# Altium schematic sheet 18.SchDoc
size 420 x 297 mm
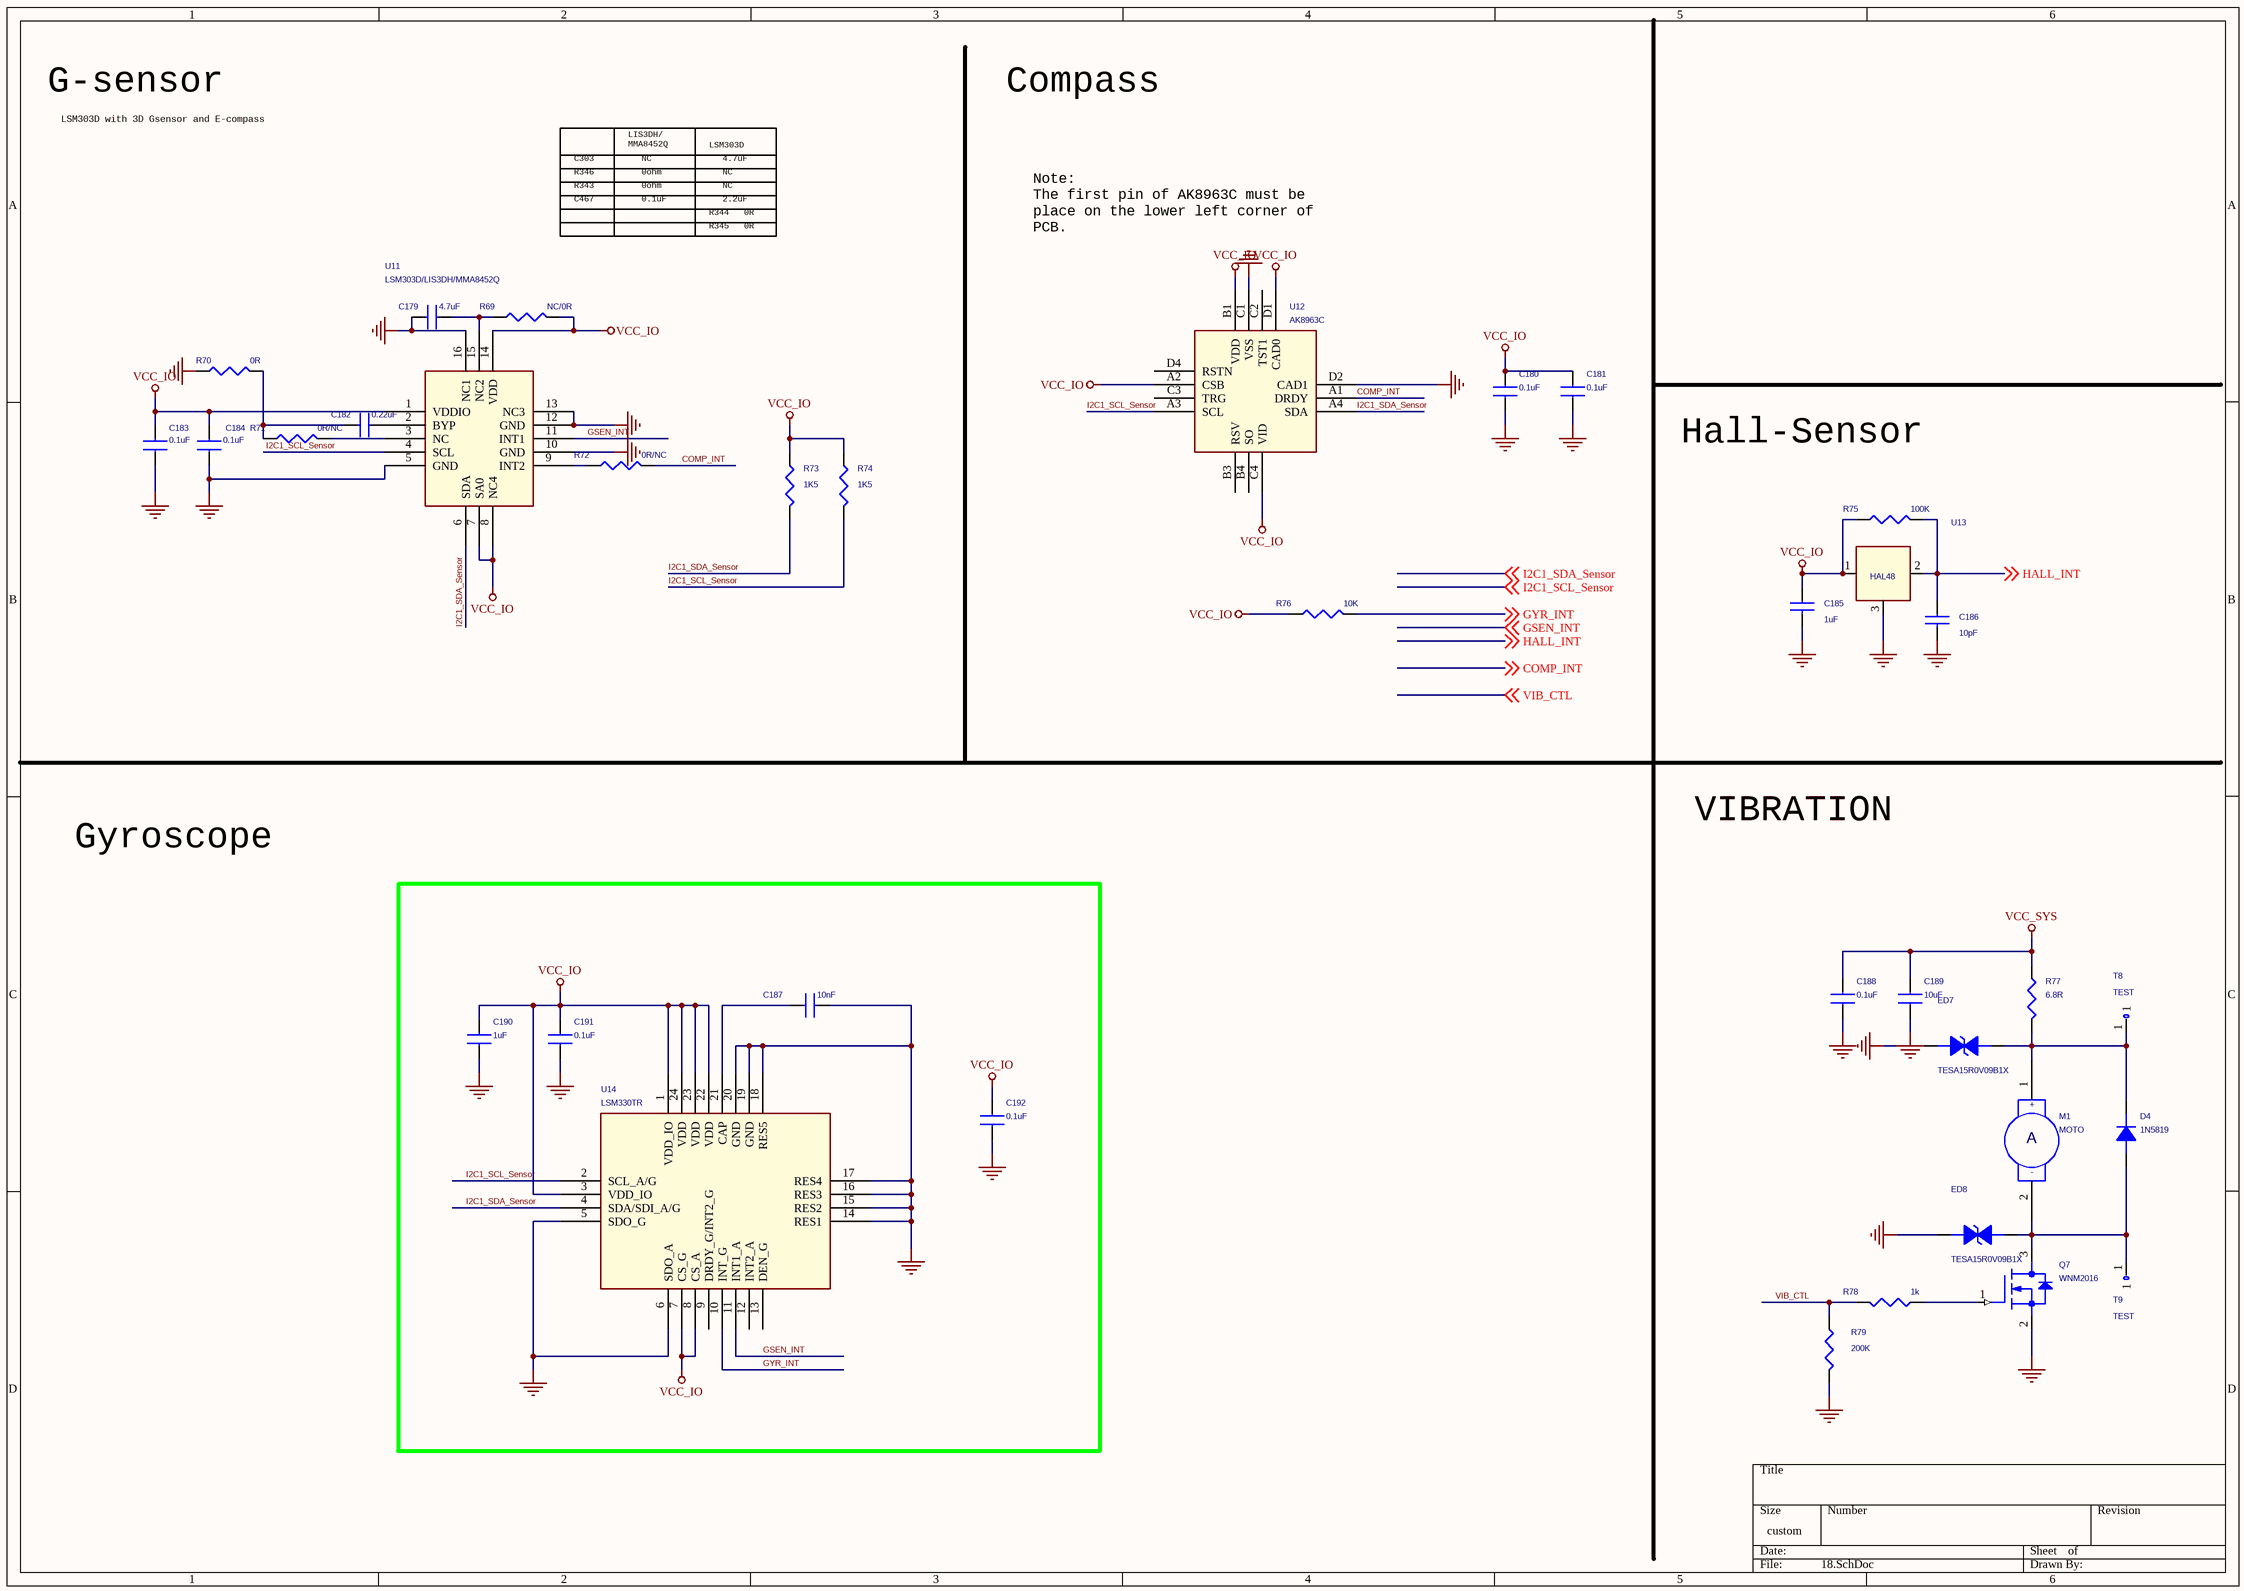
[diagram p0: 18.SchDoc]

## Parts
C179  4.7uF  [C0603]
C180  0.1uF  [C0603]
C181  0.1uF  [C0603]
C182  0.22uF  [C0603]
C183  0.1uF  [C0603]
C184  0.1uF  [C0603]
C185  1uF  [C0402]
C186  10pF  [C0402]
C187  10nF  [C0603]
C188  0.1uF  [C0603]
C189  10uF  [C0603]
C190  1uF  [C0603]
C191  0.1uF  [C0603]
C192  0.1uF  [C0603]
D4  1N5819  [SOD323]
ED7  TESA15R0V09B1X  [E0402N]
ED8  TESA15R0V09B1X  [E0402N]
M1  MOTO  [R1206]
Q7  WNM2016  [SOT23]
R69  NC/0R  [R0402]
R70  0R  [R0402]
R71  0R/NC  [R0402]
R72  0R/NC  [R0402]
R73  1K5  [r0402]
R74  1K5  [r0402]
R75  100K  [R0402]
R76  10K  [r0402]
R77  6.8R  [R0603]
R78  1k  [r0402]
R79  200K  [r0402]
T8  TEST  [TEST]
T9  TEST  [TEST]
U11  LSM303D/LIS3DH/MMA8452Q  [QFN16_COL]
U12  AK8963C  [AK8975B]
U13  HAL48  [SOT23]
U14  LSM330TR  [L3G4200D]

## Nets
GND: C179.2 C180.1 C181.1 C183.1 C184.1 C185.2 C186.2 C187.1 C188.1 C189.1 C190.1 C191.1 C192.1 ED7.1 ED8.1 Q7.2(SOURCE) R70.1 R79.2 U11.5(GND) U11.10(GND) U11.12(GND) U11.13(NC3) U11.16(NC1) U12.C1(VSS) U12.D2(CAD1) U13.3 U14.5(SDO_G) U14.6(SDO_A) U14.14(RES1) U14.15(RES2) U14.16(RES3) U14.17(RES4) U14.18(RES5) U14.19(GND) U14.20(GND)
VCC_IO: C180.2 C181.2 C183.2 C184.2 C185.1 C190.2 C191.2 C192.2 R69.2 R73.1 R74.1 R75.1 R76.1 U11.1(VDDIO) U11.7(SA0) U11.8(NC4) U11.14(VDD) U12.A2(CSB) U12.B1(VDD) U12.C4(VID) U12.D1(CAD0) U13.1 U14.1(VDD_IO) U14.3(VDD_IO) U14.7(CS_G) U14.8(CS_A) U14.22(VDD) U14.23(VDD) U14.24(VDD)
VCC_SYS: C188.2 C189.2 R77.1
COMP_INT: R72.2 U12.A1(DRDY) ; off-sheet COMP_INT
GSEN_INT: U11.11(INT1) U14.11(INT1_A) ; off-sheet GSEN_INT
GYR_INT: R76.2 U14.10(INT_G) ; off-sheet GYR_INT
HALL_INT: C186.1 R75.2 U13.2 ; off-sheet HALL_INT
I2C1_SCL_Sensor: R74.2 U11.4(SCL) U12.A3(SCL) U14.2(SCL_A/G) ; off-sheet I2C1_SCL_Sensor
I2C1_SDA_Sensor: R73.2 U11.6(SDA) U12.A4(SDA) U14.4(SDA/SDI_A/G) ; off-sheet I2C1_SDA_Sensor
VIB_CTL: R78.2 R79.1 ; off-sheet VIB_CTL
NetC179_1: C179.1 R69.1 U11.15(NC2)
NetC182_1: C182.1 U11.2(BYP)
NetC182_2: C182.2 R70.2 R71.1
NetC187_2: C187.2 U14.21(CAP)
NetD4_1: D4.1(A) ED8.2 M1.2(-) Q7.3(DRAIN) T9.1
NetD4_2: D4.2(K) ED7.2 M1.1(+) R77.2 T8.1
NetQ7_1: Q7.1(GATE) R78.1
NetR71_2: R71.2 U11.3(NC)
NetR72_1: R72.1 U11.9(INT2)

Not connected (* = marked no-connect by the designer): U12 B3(RSV) B4(SO) C2(TST1) C3(TRG) D4(RSTN); U14 9(DRDY_G/INT2_G) 12(INT2_A) 13(DEN_G)

## Notes on the sheet
- G-sensor
- LSM303D with 3D Gsensor and E-compass
- Compass
- R346
- R343
- C303
- LIS3DH/
  MMA8452Q
- 0ohm
- NC
- LSM303D
- 4.7uF
- C467
- 0.1uF
- R345   0R
- R344   0R
- 2.2uF
- Note:
  The first pin of AK8963C must be
  place on the lower left corner of
  PCB.
- Hall-Sensor
- Gyroscope
- VIBRATION
- (in symbol MOTOR SERVO) A

## Library data of the parts
C179 = CAP NP_Dup3: RoHS CHIP CAP 4.7uF +10/-10% X5R
C180 C181 = CAP NP_Dup3
C182 = CAP NP_Dup3: RoHS CHIP CAP 0.22uF +10/-10% X7R
C183 C184 = CAP NP_Dup3: RoHS CHIP CAP 0.1uF +10/-10% X7R
C185 C186 = CAP NP_Dup2: RoHS CHIP CAP 0.1uF +10/-10% X7R
C187 C191 C192 = CAP NP: CAP,MLCC,100nF,+/-10%,X7R,6.3V,SMD0402
C188 = CAP NP_Dup3: CAP,MLCC,100nF,+/-10%,X7R,6.3V,SMD0402
C189 = CAP NP_Dup3: CAP,MLCC,10uF,+/-10%,X5R,6.3V,SMD0805; MARK: 105
C190 = CAP NP: CAP,MLCC,10uF,+/-10%,X5R,6.3V,SMD0805
D4 = DIODE_Dup2: Diode,Schottky,1N5819HW,40V,1A,SOD-123
ED7 ED8 = TVS: ESD Component,5V,30P,SMD,0402
M1 = MOTOR SERVO: Vibration,R1206,SMT
Q7 = FET N MOS
R69 R71 R72 = RESISTOR_Dup1: NC/ROHS CHIP RES 0R 1/16W +/-5%
R70 = RESISTOR_Dup1: ROHS CHIP RES 0 Ohm 1/16W +/-5%
R73 R74 = RESISTOR_0_Dup3
R75 = RESISTOR_Dup1: ROHS CHIP RES 10K 1/16W 1%
R76 = RES 1B
R77 = RESISTOR_0: RES,thick film,43Ohm,+/-1%,1/8W,SMD0805
R78 R79 = RESISTOR_0_Dup3: RES,thick film,47KOhm,+/-5%,1/16W,SMD0402
T8 T9 = TEST_0
U11 = MMA8452Q_0: G_Sensor,LIS3DH/MMA8452Q,1.95V~3.6V,LGA-16,3X3X1.0,-40°C ~ +85°C
U12 = AK8975C_0: 3-axis Electronic Compoass,AK8963C,2.4V~3.6V,BGA14,-40°C~ +85  °C
U13 = NPN_0: Trans NPN,SS8050,25V,1500mA,10~60@Vce=1V,Ic=500mA, SOT-23
U14 = LSM330